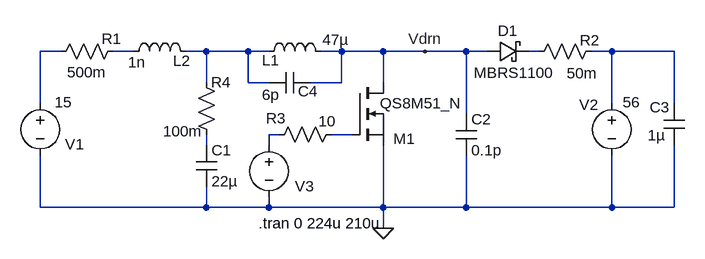
[diagram p0: schematic BMS_Charger210119.asc]
BMS_Charger210119.asc, the LTspice schematic file:
Version 4
SHEET 1 1652 680
WIRE 208 -80 176 -80
WIRE 320 -80 288 -80
WIRE 432 -80 400 -80
WIRE 496 -80 432 -80
WIRE 528 -80 496 -80
WIRE 640 -80 608 -80
WIRE 704 -80 640 -80
WIRE 768 -80 704 -80
WIRE 832 -80 768 -80
WIRE 864 -80 832 -80
WIRE 944 -80 928 -80
WIRE 1056 -80 1024 -80
WIRE 1152 -80 1056 -80
WIRE 432 -32 432 -80
WIRE 496 -32 496 -80
WIRE 528 -32 496 -32
WIRE 640 -32 640 -80
WIRE 640 -32 592 -32
WIRE 704 -32 704 -80
WIRE 176 0 176 -80
WIRE 1056 0 1056 -80
WIRE 1152 0 1152 -80
WIRE 832 16 832 -80
WIRE 544 48 528 48
WIRE 656 48 624 48
WIRE 432 64 432 48
WIRE 528 64 528 48
WIRE 176 160 176 80
WIRE 432 160 432 128
WIRE 432 160 176 160
WIRE 528 160 528 144
WIRE 528 160 432 160
WIRE 704 160 704 64
WIRE 704 160 528 160
WIRE 832 160 832 80
WIRE 832 160 704 160
WIRE 1056 160 1056 80
WIRE 1056 160 832 160
WIRE 1152 160 1152 64
WIRE 1152 160 1056 160
WIRE 704 192 704 160
FLAG 704 192 0
FLAG 768 -80 Vdrn
SYMBOL ind 512 -64 R270
WINDOW 0 -13 19 VTop 2
WINDOW 3 50 119 VBottom 2
SYMATTR InstName L1
SYMATTR Value 47µ
SYMATTR SpiceLine Ipk=2.8 Rser=0.07052 Rpar=4427.4 Cpar=0 mfg="Coilcraft" pn="RFB1010-470"
SYMBOL nmos 656 -32 R0
WINDOW 0 64 86 Left 2
WINDOW 3 43 32 Left 2
SYMATTR InstName M1
SYMATTR Value QS8M51_N
SYMBOL voltage 176 -16 R0
WINDOW 0 38 79 Left 2
WINDOW 3 22 14 Left 2
WINDOW 123 0 0 Left 0
WINDOW 39 0 0 Left 0
SYMATTR InstName V1
SYMATTR Value 15
SYMBOL voltage 1056 -16 R0
WINDOW 0 -50 18 Left 2
WINDOW 3 17 14 Left 2
WINDOW 123 0 0 Left 0
WINDOW 39 24 124 Left 2
SYMATTR InstName V2
SYMATTR Value 56
SYMBOL voltage 528 48 R0
WINDOW 0 40 79 Left 2
WINDOW 3 24 96 Invisible 2
WINDOW 123 0 0 Left 0
WINDOW 39 0 0 Left 0
SYMATTR InstName V3
SYMATTR Value PULSE(0 5 0 10n 10n 3.4u 7u)
SYMBOL res 192 -64 R270
WINDOW 0 20 94 VTop 2
WINDOW 3 0 56 VBottom 2
SYMATTR InstName R1
SYMATTR Value 500m
SYMBOL res 928 -64 R270
WINDOW 0 18 94 VTop 2
WINDOW 3 -2 82 VBottom 2
SYMATTR InstName R2
SYMATTR Value 50m
SYMBOL res 528 64 R270
WINDOW 0 26 11 VTop 2
WINDOW 3 52 90 VBottom 2
SYMATTR InstName R3
SYMATTR Value 10
SYMBOL ind 304 -64 R270
WINDOW 0 -14 90 VTop 2
WINDOW 3 15 21 VBottom 2
SYMATTR InstName L2
SYMATTR Value 1n
SYMATTR SpiceLine Ipk=5 Rser=0.1
SYMBOL cap 416 64 R0
SYMATTR InstName C1
SYMATTR Value 22µ
SYMBOL res 416 -48 R0
WINDOW 0 23 15 Left 2
WINDOW 3 -51 91 Left 2
SYMATTR InstName R4
SYMATTR Value 100m
SYMBOL cap 816 16 R0
SYMATTR InstName C2
SYMATTR Value 0.1p
SYMBOL cap 1136 0 R0
WINDOW 3 -25 49 Left 2
WINDOW 0 -22 6 Left 2
SYMATTR Value 1µ
SYMATTR InstName C3
SYMBOL cap 592 -48 R90
WINDOW 0 45 4 VBottom 2
WINDOW 3 19 61 VTop 2
SYMATTR InstName C4
SYMATTR Value 6p
SYMBOL schottky 864 -64 R270
WINDOW 0 32 32 VTop 2
WINDOW 3 -1 41 VBottom 2
SYMATTR InstName D1
SYMATTR Value MBRS1100
SYMATTR Description Diode
SYMATTR Type diode
TEXT 512 184 Left 2 !.tran 0 224u 210u

The netlist it stands for:
* BMS_Charger210119.asc
L1 N003 Vdrn 47µ Ipk=2.8 Rser=0.07052 Rpar=4427.4 Cpar=0 mfg="Coilcraft" pn="RFB1010-470"
M1 Vdrn N007 0 0 QS8M51_N
V1 N001 0 15
V2 N005 0 56
V3 N006 0 PULSE(0 5 0 10n 10n 3.4u 7u)
R1 N001 N002 500m
R2 N004 N005 50m
R3 N006 N007 10
L2 N002 N003 1n Ipk=5 Rser=0.1
C1 N008 0 22µ
R4 N003 N008 100m
C2 Vdrn 0 0.1p
C3 N005 0 1µ
C4 Vdrn N003 6p
D1 Vdrn N004 MBRS1100
.model D D
.lib standard.dio
.model NMOS NMOS
.model PMOS PMOS
.lib standard.mos
.tran 0 224u 210u
.backanno
.end